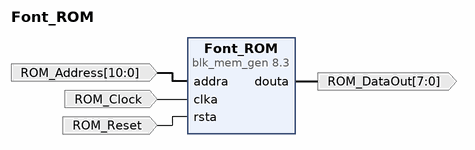
[diagram p0: block diagram of the top level]
# Vivado block design Font_ROM, xc7z010clg400-1, Vivado 2016.4
create_bd_design Font_ROM

create_bd_port -dir I -from 10 -to 0 ROM_Address
create_bd_port -dir I ROM_Clock
create_bd_port -dir O -from 7 -to 0 ROM_DataOut
create_bd_port -dir I ROM_Reset

create_bd_cell -type ip -vlnv xilinx.com:ip:blk_mem_gen:8.3 Font_ROM
set_property -dict {CONFIG.Coe_File ../../../../../../Font.coe} [get_bd_cells Font_ROM]

# ---- connections ----

connect_bd_net -net addra_1 [get_bd_ports ROM_Address] [get_bd_pins Font_ROM/addra]
connect_bd_net -net clka_1 [get_bd_ports ROM_Clock] [get_bd_pins Font_ROM/clka]
connect_bd_net -net blk_mem_gen_0_douta [get_bd_pins Font_ROM/douta] [get_bd_ports ROM_DataOut]
connect_bd_net -net rsta_1 [get_bd_ports ROM_Reset] [get_bd_pins Font_ROM/rsta]

validate_bd_design
save_bd_design
